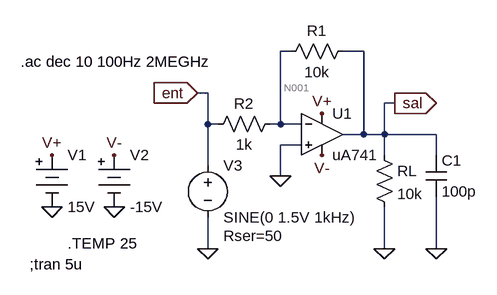
[diagram p0: schematic E9-uA741.asc]
E9-uA741.asc, the LTspice schematic file:
Version 4
SHEET 1 880 680
WIRE 336 16 320 16
WIRE 448 16 416 16
WIRE 208 80 192 80
WIRE 496 96 480 96
WIRE 208 128 208 80
WIRE 224 128 208 128
WIRE 320 128 320 16
WIRE 320 128 304 128
WIRE 352 128 320 128
WIRE 448 144 448 16
WIRE 448 144 416 144
WIRE 480 144 480 96
WIRE 480 144 448 144
WIRE 560 144 480 144
WIRE 352 160 320 160
WIRE 480 176 480 144
WIRE 560 176 560 144
WIRE 208 192 208 128
WIRE 320 208 320 160
WIRE 208 320 208 272
WIRE 480 320 480 256
WIRE 560 320 560 240
FLAG -32 256 0
FLAG 64 256 0
FLAG 208 320 0
FLAG 320 208 0
FLAG -32 176 V+
FLAG 384 112 V+
FLAG 64 176 V-
FLAG 384 176 V-
FLAG 480 320 0
FLAG 560 320 0
FLAG 496 96 sal
IOPIN 496 96 Out
FLAG 192 80 ent
IOPIN 192 80 In
SYMBOL Misc\\battery -32 160 R0
SYMATTR InstName V1
SYMATTR Value 15V
SYMBOL Misc\\battery 64 160 R0
SYMATTR InstName V2
SYMATTR Value -15V
SYMBOL voltage 208 176 R0
WINDOW 123 24 152 Left 2
WINDOW 39 24 124 Left 2
SYMATTR InstName V3
SYMATTR Value SINE(0 1.5V 1kHz)
SYMATTR SpiceLine Rser=50
SYMBOL Mis_Componentes\\uA741 384 144 R0
SYMATTR InstName U1
SYMBOL res 432 0 R90
WINDOW 0 0 56 VBottom 2
WINDOW 3 32 56 VTop 2
SYMATTR InstName R1
SYMATTR Value 10k
SYMBOL res 320 112 R90
WINDOW 0 0 56 VBottom 2
WINDOW 3 32 56 VTop 2
SYMATTR InstName R2
SYMATTR Value 1k
SYMBOL res 464 160 R0
SYMATTR InstName RL
SYMATTR Value 10k
SYMBOL cap 544 176 R0
SYMATTR InstName C1
SYMATTR Value 100p
TEXT -8 312 Left 2 !.TEMP 25
TEXT -66 344 Left 2 !;tran 5u
TEXT -80 32 Left 2 !.ac dec 10 100Hz 2MEGHz

The netlist it stands for:
* E9-uA741.asc
V1 V+ 0 15V
V2 V- 0 -15V
V3 ent 0 SINE(0 1.5V 1kHz) Rser=50
XU1 0 N001 V+ V- sal uA741  ; pins In+ In- V+ V- OUT
R1 sal N001 10k
R2 N001 ent 1k
RL sal 0 10k
C1 sal 0 100p
.TEMP 25
;tran 5u
.ac dec 10 100Hz 2MEGHz
.lib UA741.sub
.backanno
.end

* Results of the author's LTspice run, read from the files saved beside the schematic
* Operating Point, zero values left out:
*   V(v+) = 15 V
*   V(v-) = -15 V
*   V(ent) = 918.5 nV
*   V(sal) = 1.001 mV
*   V(n001) = 19.29 µV
*   I(Rl) = 100.1 nA
*   I(R2) = 18.37 nA
*   I(R1) = 98.13 nA
*   I(V3) = 18.37 nA
*   I(V2) = 1.667 mA
*   I(V1) = -1.667 mA
*   Ix(u1:1) = 79.72 nA
*   Ix(u1:2) = 79.76 nA
*   Ix(u1:3) = 1.667 mA
*   Ix(u1:4) = -1.667 mA
*   Ix(u1:5) = -198.2 nA